# Altium schematic sheet Connectors.SchDoc
size A4
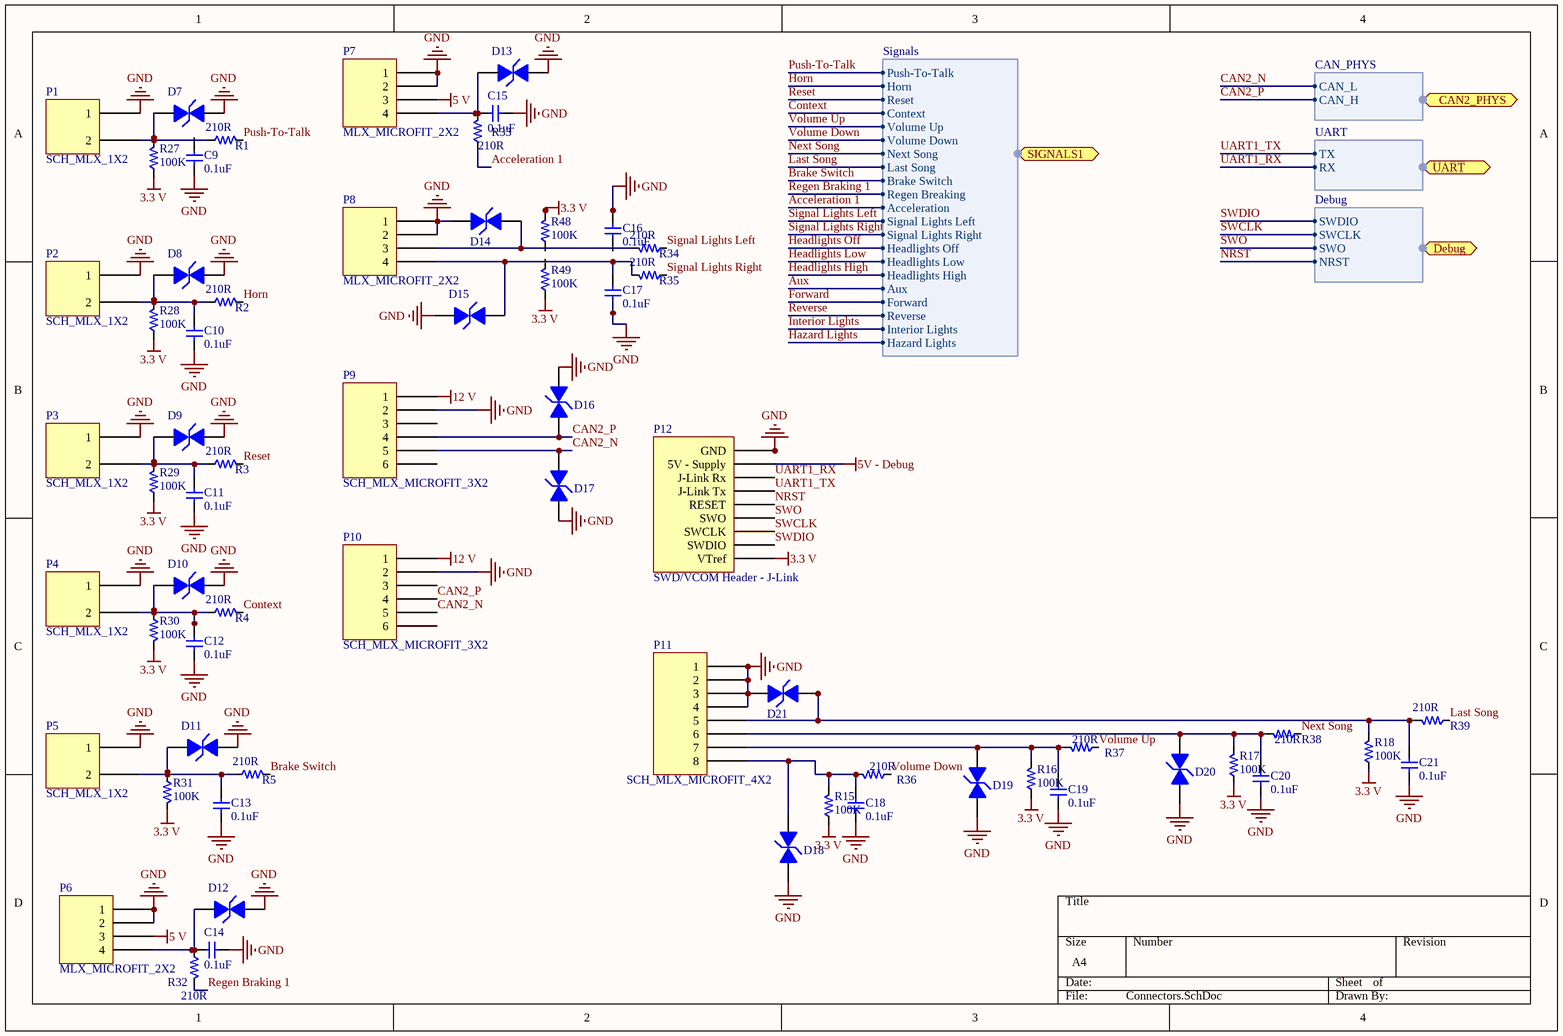
[diagram p0: Connectors.SchDoc]

## Parts
C9  value 0.1uF  [PCB_GENERIC_SMD_0603]  (hidden comment: C060-000U1-00)
C10  value 0.1uF  [PCB_GENERIC_SMD_0603]  (hidden comment: C060-000U1-00)
C11  value 0.1uF  [PCB_GENERIC_SMD_0603]  (hidden comment: C060-000U1-00)
C12  value 0.1uF  [PCB_GENERIC_SMD_0603]  (hidden comment: C060-000U1-00)
C13  value 0.1uF  [PCB_GENERIC_SMD_0603]  (hidden comment: C060-000U1-00)
C14  value 0.1uF  [PCB_GENERIC_SMD_0603]  (hidden comment: C060-000U1-00)
C15  value 0.1uF  [PCB_GENERIC_SMD_0603]  (hidden comment: C060-000U1-00)
C16  value 0.1uF  [PCB_GENERIC_SMD_0603]  (hidden comment: C060-000U1-00)
C17  value 0.1uF  [PCB_GENERIC_SMD_0603]  (hidden comment: C060-000U1-00)
C18  value 0.1uF  [PCB_GENERIC_SMD_0603]  (hidden comment: C060-000U1-00)
C19  value 0.1uF  [PCB_GENERIC_SMD_0603]  (hidden comment: C060-000U1-00)
C20  value 0.1uF  [PCB_GENERIC_SMD_0603]  (hidden comment: C060-000U1-00)
C21  value 0.1uF  [PCB_GENERIC_SMD_0603]  (hidden comment: C060-000U1-00)
D7  TVS Diode  [TVS Diode]  (value not drawn)
D8  TVS Diode  [TVS Diode]  (value not drawn)
D9  TVS Diode  [TVS Diode]  (value not drawn)
D10  TVS Diode  [TVS Diode]  (value not drawn)
D11  TVS Diode  [TVS Diode]  (value not drawn)
D12  TVS Diode  [TVS Diode]  (value not drawn)
D13  TVS Diode  [TVS Diode]  (value not drawn)
D14  TVS Diode  [TVS Diode]  (value not drawn)
D15  TVS Diode  [TVS Diode]  (value not drawn)
D16  TVS Diode  [TVS Diode]  (value not drawn)
D17  TVS Diode  [TVS Diode]  (value not drawn)
D18  TVS Diode  [TVS Diode]  (value not drawn)
D19  TVS Diode  [TVS Diode]  (value not drawn)
D20  TVS Diode  [TVS Diode]  (value not drawn)
D21  TVS Diode  [TVS Diode]  (value not drawn)
P1  SCH_MLX_1X2  [PCB_MLX_MICROFIT_1X2]
P2  SCH_MLX_1X2  [PCB_MLX_MICROFIT_1X2]
P3  SCH_MLX_1X2  [PCB_MLX_MICROFIT_1X2]
P4  SCH_MLX_1X2  [PCB_MLX_MICROFIT_1X2]
P5  SCH_MLX_1X2  [PCB_MLX_MICROFIT_1X2]
P6  MLX_MICROFIT_2X2  [MLX_MICROFIT_2X2]
P7  MLX_MICROFIT_2X2  [MLX_MICROFIT_2X2]
P8  MLX_MICROFIT_2X2  [MLX_MICROFIT_2X2]
P9  SCH_MLX_MICROFIT_3X2  [PCB_MLX_MICROFIT_3X2]
P10  SCH_MLX_MICROFIT_3X2  [PCB_MLX_MICROFIT_3X2]
P11  SCH_MLX_MICROFIT_4X2  [PCB_MLX_MICROFIT_4X2]
P12  SWD/VCOM Header - J-Link  [Samtec TST-110-01-G-D]
R1  Resistance: 210R  [PCB_GENERIC_SMD_0603]  (hidden comment: SCH_GENERIC_RESISTOR_0603)
R2  Resistance: 210R  [PCB_GENERIC_SMD_0603]  (hidden comment: SCH_GENERIC_RESISTOR_0603)
R3  Resistance: 210R  [PCB_GENERIC_SMD_0603]  (hidden comment: SCH_GENERIC_RESISTOR_0603)
R4  Resistance: 210R  [PCB_GENERIC_SMD_0603]  (hidden comment: SCH_GENERIC_RESISTOR_0603)
R5  Resistance: 210R  [PCB_GENERIC_SMD_0603]  (hidden comment: SCH_GENERIC_RESISTOR_0603)
R15  value 100K  [PCB_GENERIC_SMD_0603]  (hidden comment: R060-00104-05)
R16  value 100K  [PCB_GENERIC_SMD_0603]  (hidden comment: R060-00104-05)
R17  value 100K  [PCB_GENERIC_SMD_0603]  (hidden comment: R060-00104-05)
R18  value 100K  [PCB_GENERIC_SMD_0603]  (hidden comment: R060-00104-05)
R27  value 100K  [PCB_GENERIC_SMD_0603]  (hidden comment: R060-00104-05)
R28  value 100K  [PCB_GENERIC_SMD_0603]  (hidden comment: R060-00104-05)
R29  value 100K  [PCB_GENERIC_SMD_0603]  (hidden comment: R060-00104-05)
R30  value 100K  [PCB_GENERIC_SMD_0603]  (hidden comment: R060-00104-05)
R31  value 100K  [PCB_GENERIC_SMD_0603]  (hidden comment: R060-00104-05)
R32  Resistance: 210R  [PCB_GENERIC_SMD_0603]  (hidden comment: SCH_GENERIC_RESISTOR_0603)
R33  Resistance: 210R  [PCB_GENERIC_SMD_0603]  (hidden comment: SCH_GENERIC_RESISTOR_0603)
R34  Resistance: 210R  [PCB_GENERIC_SMD_0603]  (hidden comment: SCH_GENERIC_RESISTOR_0603)
R35  Resistance: 210R  [PCB_GENERIC_SMD_0603]  (hidden comment: SCH_GENERIC_RESISTOR_0603)
R36  Resistance: 210R  [PCB_GENERIC_SMD_0603]  (hidden comment: SCH_GENERIC_RESISTOR_0603)
R37  Resistance: 210R  [PCB_GENERIC_SMD_0603]  (hidden comment: SCH_GENERIC_RESISTOR_0603)
R38  Resistance: 210R  [PCB_GENERIC_SMD_0603]  (hidden comment: SCH_GENERIC_RESISTOR_0603)
R39  Resistance: 210R  [PCB_GENERIC_SMD_0603]  (hidden comment: SCH_GENERIC_RESISTOR_0603)
R48  value 100K  [PCB_GENERIC_SMD_0603]  (hidden comment: R060-00104-05)
R49  value 100K  [PCB_GENERIC_SMD_0603]  (hidden comment: R060-00104-05)

## Ports
CAN2_PHYS (harness CAN_PHYS), Debug (harness Debug), SIGNALS1 (harness Signals), UART (harness UART)

## Harnesses
Signals: Push-To-Talk, Horn, Reset, Context, Volume Up, Volume Down, Next Song, Last Song, Brake Switch, Regen Breaking, Acceleration, Signal Lights Left, Signal Lights Right, Headlights Off, Headlights Low, Headlights High, Aux, Forward, Reverse, Interior Lights, Hazard Lights
CAN_PHYS: CAN_L, CAN_H
UART: TX, RX
Debug: SWDIO, SWCLK, SWO, NRST

## Nets
3.3 V: P12.1(VTref) R17.1 R18.1 R48.2
5 V: P6.3 P7.3
5V - Debug: P12.19(5V_-_Supply)
12 V: P9.1 P10.1
GND: C16.1 C17.1 C20.1 C21.1 D7.1 D8.2 D9.2 D10.2 D11.2 D12.2 D13.2 D14.1 D15.1 D16.2 D17.1 D18.2 D19.2 D20.2 D21.1 P1.1 P2.1 P3.1 P4.1 P5.1 P6.1 P6.2 P7.1 P7.2 P8.1 P8.2 P9.2 P10.2 P11.1 P11.2 P11.3 P11.4 P12.4(GND) P12.6(GND) P12.8(GND) P12.10(GND) P12.12(GND)
Acceleration 1: R33.1 ; port SIGNALS1.Acceleration
Aux: port SIGNALS1.Aux
Brake Switch: R5.2 ; port SIGNALS1.Brake Switch
CAN2_N: D17.2 P9.5 P10.5 ; port CAN2_PHYS.CAN_L
CAN2_P: D16.1 P9.4 P10.4 ; port CAN2_PHYS.CAN_H
Context: R4.2 ; port SIGNALS1.Context
Forward: port SIGNALS1.Forward
Hazard Lights: port SIGNALS1.Hazard Lights
Headlights High: port SIGNALS1.Headlights High
Headlights Low: port SIGNALS1.Headlights Low
Headlights Off: port SIGNALS1.Headlights Off
Horn: R2.2 ; port SIGNALS1.Horn
Interior Lights: port SIGNALS1.Interior Lights
Last Song: R39.1 ; port SIGNALS1.Last Song
Next Song: R38.1 ; port SIGNALS1.Next Song
NRST: P12.15(RESET) ; port Debug.NRST
Push-To-Talk: R1.2 ; port SIGNALS1.Push-To-Talk
Regen Braking 1: R32.2 ; port SIGNALS1.Regen Breaking
Reset: R3.2 ; port SIGNALS1.Reset
Reverse: port SIGNALS1.Reverse
Signal Lights Left: R34.1 ; port SIGNALS1.Signal Lights Left
Signal Lights Right: R35.1 ; port SIGNALS1.Signal Lights Right
SWCLK: P12.9(SWCLK) ; port Debug.SWCLK
SWDIO: P12.7(SWDIO) ; port Debug.SWDIO
SWO: P12.13(SWO) ; port Debug.SWO
UART1_RX: P12.17(J-Link_Rx) ; port UART.RX
UART1_TX: P12.5(J-Link_Tx) ; port UART.TX
Volume Down: R36.1 ; port SIGNALS1.Volume Down
Volume Up: R37.1 ; port SIGNALS1.Volume Up
NetC10_2: C10.2 D8.1 P2.2 R2.1 R28.2
NetC11_2: C11.2 D9.1 P3.2 R3.1 R29.2
NetC12_1: C12.1 D10.1 P4.2 R4.1 R30.1
NetC13_1: C13.1 D11.1 P5.2 R5.1 R31.1
NetC14_1: C14.1 D12.1 P6.4 R32.1
NetC15_2: C15.2 D13.1 P7.4 R33.2
NetC17_2: C17.2 D15.2 P8.4 R35.2
NetC18_2: C18.2 D18.1 P11.8 R15.2 R36.2
NetC19_2: C19.2 D19.1 P11.7 R16.2 R37.2
NetC20_2: C20.2 D20.1 P11.6 R17.2 R38.2
NetC21_2: C21.2 D21.2 P11.5 R18.2 R39.2
NetD7_2: D7.2 P1.2 R1.1 R27.2
NetD14_2: D14.2 P8.3 R34.2

Not connected (* = marked no-connect by the designer): C9 1 2; C10 1; C11 1; C12 2; C13 2; C14 2; C15 1; C16 2; C18 1; C19 1; P9 3 6; P10 3 6; R15 1; R16 1; R27 1; R28 1; R29 1; R30 2; R31 2; R48 1; R49 1 2

## Notes on the sheet
- Labels drawn without touching a wire or pin: 3.3 V, GND

## Library data of the parts
C9-C21 = C060-000U1-00: CAP CER 0603 0.1uF 16V X5R 20%; Tolerance: 20%; Voltage: 16V; Package: 0603
D7-D21 = TVS Diode: Manufacturer: Bourns; Manufacturer ID: CDSOD323-T03SC
P11 = SCH_MLX_MICROFIT_4X2: Molex Microfit Connector 4x2
P12 = SWD/VCOM Header
R1-R5 R32-R39 = SCH_GENERIC_RESISTOR_0603: Generic SMD resistor 0603
R15-R18 R27-R31 R48 R49 = R060-00104-05: RES 0603 100K 5% 63mW; Tolerance: 5%; Power: 63mW; Package: 0603